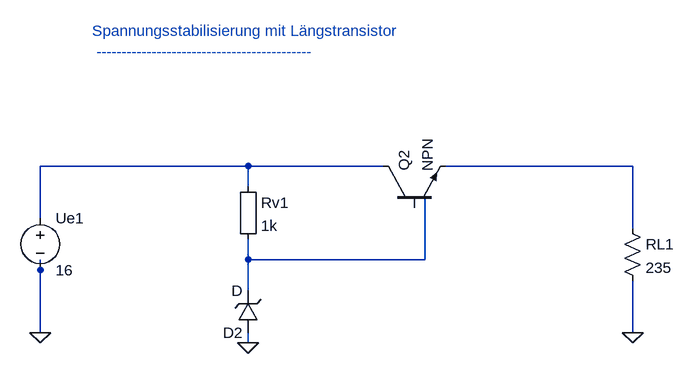
[diagram p0: schematic 5_7_4_Spannungsstabilisierung_mit_Laengstransistor.asc]
5_7_4_Spannungsstabilisierung_mit_Laengstransistor.asc, the LTspice schematic file:
Version 4
SHEET 1 880 680
WIRE 160 416 160 400
WIRE 736 320 736 304
WIRE 736 304 752 304
WIRE 784 256 816 256
WIRE 480 448 480 416
WIRE 160 512 160 400
WIRE 1072 512 1072 432
WIRE 1072 352 1072 256
WIRE 1072 256 816 256
WIRE 480 368 480 400
WIRE 688 256 480 256
WIRE 480 256 480 288
WIRE 160 336 160 256
WIRE 160 256 480 256
WIRE 480 400 752 400
WIRE 752 400 752 304
WIRE 480 416 480 400
WIRE 480 512 480 528
FLAG 160 512 0
FLAG 480 528 0
FLAG 1072 512 0
FLAG 160 512 0
FLAG 480 528 0
FLAG 1072 512 0
SYMBOL voltage 160 320 R0
SYMATTR InstName Ue1
SYMATTR Value 16
SYMBOL Misc\EuropeanResistor 464 272 R0
SYMATTR InstName Rv1
SYMATTR Value 1k
SYMBOL res 1056 336 R0
SYMATTR InstName RL1
SYMATTR Value 235
SYMBOL npn 688 320 R270
SYMATTR InstName Q2
SYMATTR Value NPN
SYMBOL zener 496 512 R180
SYMATTR InstName D2
SYMATTR Value D
TEXT 240 48 Left 2 ;Spannungsstabilisierung mit Längstransistor \n -------------------------------------------

The netlist it stands for:
* 5_7_4_Spannungsstabilisierung_mit_Laengstransistor.asc
V§Ue1 N003 0 16
Rv1 N003 N001 1k
RL1 N002 0 235
Q2 N003 N001 N002 0 NPN
D2 0 N001 D
.model D D
.lib standard.dio
.model NPN NPN
.model PNP PNP
.lib standard.bjt
* Spannungsstabilisierung mit Längstransistor
*  -------------------------------------------
.backanno
.end